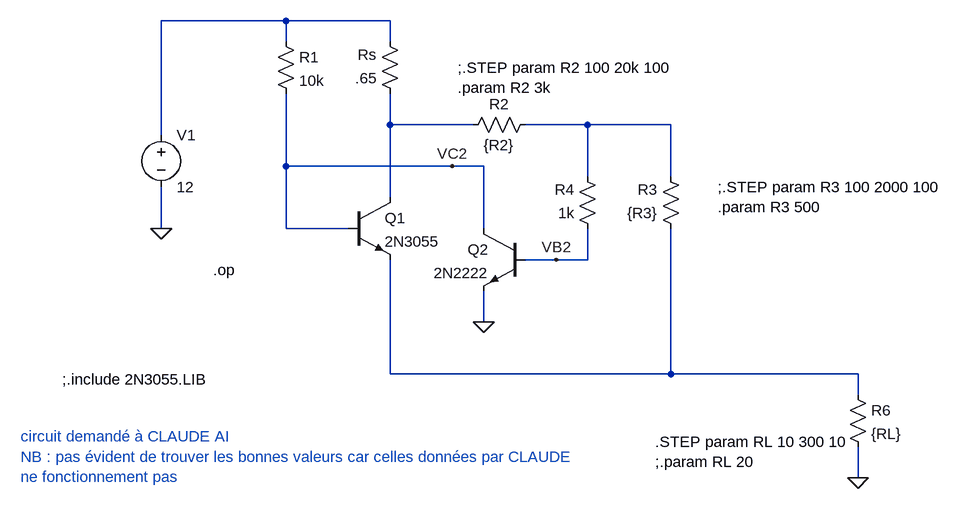
[diagram p0: schematic Foldback-NPN-02.asc]
Foldback-NPN-02.asc, the LTspice schematic file:
Version 4.1
SHEET 1 1348 680
WIRE 96 -160 -96 -160
WIRE 256 -160 96 -160
WIRE 96 -128 96 -160
WIRE 256 -128 256 -160
WIRE 256 0 256 -48
WIRE 384 0 256 0
WIRE 560 0 464 0
WIRE 688 0 560 0
WIRE -96 16 -96 -160
WIRE 96 64 96 -48
WIRE 352 64 96 64
WIRE 400 64 352 64
WIRE 560 80 560 0
WIRE 688 80 688 0
WIRE 256 112 256 0
WIRE -96 160 -96 96
WIRE 96 160 96 64
WIRE 192 160 96 160
WIRE 400 160 400 64
WIRE 512 208 464 208
WIRE 560 208 560 160
WIRE 560 208 512 208
WIRE 400 304 400 256
WIRE 256 384 256 208
WIRE 688 384 688 160
WIRE 688 384 256 384
WIRE 976 384 688 384
WIRE 976 416 976 384
WIRE 976 544 976 496
FLAG -96 160 0
FLAG 976 544 0
FLAG 400 304 0
FLAG 512 208 VB2
FLAG 352 64 VC2
SYMBOL npn 192 112 R0
SYMATTR InstName Q1
SYMATTR Value 2N3055
SYMBOL npn 464 160 M0
SYMATTR InstName Q2
SYMATTR Value 2N2222
SYMBOL res 80 -144 R0
SYMATTR InstName R1
SYMATTR Value 10k
SYMBOL res 480 -16 R90
WINDOW 0 0 56 VBottom 2
WINDOW 3 32 56 VTop 2
SYMATTR InstName R2
SYMATTR Value {R2}
SYMBOL res 704 176 R180
WINDOW 0 36 76 Left 2
WINDOW 3 36 40 Left 2
SYMATTR InstName R3
SYMATTR Value {R3}
SYMBOL res 576 176 R180
WINDOW 0 36 76 Left 2
WINDOW 3 36 40 Left 2
SYMATTR InstName R4
SYMATTR Value 1k
SYMBOL res 272 -32 R180
WINDOW 0 36 76 Left 2
WINDOW 3 36 40 Left 2
SYMATTR InstName Rs
SYMATTR Value .65
SYMBOL voltage -96 0 R0
WINDOW 123 0 0 Left 0
WINDOW 39 0 0 Left 0
SYMATTR InstName V1
SYMATTR Value 12
SYMBOL res 960 400 R0
SYMATTR InstName R6
SYMATTR Value {RL}
TEXT -16 224 Left 2 !.op
TEXT 664 488 Left 2 !.STEP param RL 10 300 10\n;.param RL 20
TEXT -312 480 Left 2 ;circuit demandé à CLAUDE AI\nNB : pas évident de trouver les bonnes valeurs car celles données par CLAUDE\nne fonctionnement pas
TEXT 360 -88 Left 2 !;.STEP param R2 100 20k 100\n.param R2 3k
TEXT 760 96 Left 2 !;.STEP param R3 100 2000 100\n.param R3 500
TEXT -248 392 Left 2 !;.include 2N3055.LIB

The netlist it stands for:
* Foldback-NPN-02.asc
Q1 N002 VC2 N004 0 2N3055
Q2 VC2 VB2 0 0 2N2222
R1 N001 VC2 10k
R2 N003 N002 {R2}
R3 N004 N003 {R3}
R4 VB2 N003 1k
Rs N002 N001 .65
V1 N001 0 12
R6 N004 0 {RL}
.model NPN NPN
.model PNP PNP
.lib standard.bjt
.op
.STEP param RL 10 300 10
;.param RL 20
* circuit demandé à CLAUDE AI
* NB : pas évident de trouver les bonnes valeurs car celles données par CLAUDE
* ne fonctionnement pas
;.STEP param R2 100 20k 100
.param R2 3k
;.STEP param R3 100 2000 100
.param R3 500
;.include 2N3055.LIB
.backanno
.end